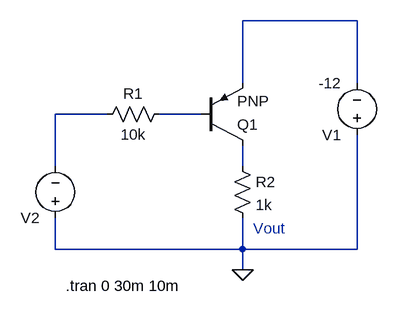
[diagram p0: schematic lab4_2.asc]
lab4_2.asc, the LTspice schematic file:
Version 4
SHEET 1 880 680
WIRE 544 -64 368 -64
WIRE 368 32 368 -64
WIRE 544 32 544 -64
WIRE 160 80 80 80
WIRE 304 80 240 80
WIRE 80 160 80 80
WIRE 368 160 368 128
WIRE 80 288 80 240
WIRE 368 288 368 240
WIRE 368 288 80 288
WIRE 544 288 544 112
WIRE 544 288 368 288
WIRE 368 320 368 288
FLAG 368 320 0
SYMBOL voltage 80 256 R180
WINDOW 3 24 96 Invisible 2
WINDOW 123 0 0 Left 0
WINDOW 39 0 0 Left 0
SYMATTR Value PULSE(0 -12 10e-3 10e-3 10e-3 10e-3 30e-3 1)
SYMATTR InstName V2
SYMBOL res 144 96 R270
WINDOW 0 32 56 VTop 2
WINDOW 3 0 56 VBottom 2
SYMATTR InstName R1
SYMATTR Value 10k
SYMBOL res 352 144 R0
SYMATTR InstName R2
SYMATTR Value 1k
SYMBOL voltage 544 128 R180
WINDOW 123 0 0 Left 0
WINDOW 39 0 0 Left 0
SYMATTR InstName V1
SYMATTR Value -12
SYMBOL pnp 304 128 M180
SYMATTR InstName Q1
TEXT 96 344 Left 2 !.tran 0 30m 10m
TEXT 384 256 Left 2 ;Vout

The netlist it stands for:
* lab4_2.asc
V2 0 N002 PULSE(0 -12 10e-3 10e-3 10e-3 10e-3 30e-3 1)
R1 N002 N003 10k
R2 N004 0 1k
V1 0 N001 -12
Q1 N004 N003 N001 0 PNP
.model NPN NPN
.model PNP PNP
.lib standard.bjt
.tran 0 30m 10m
* Vout
.backanno
.end